# Altium schematic sheet SY8029AIC.SchDoc
size A4
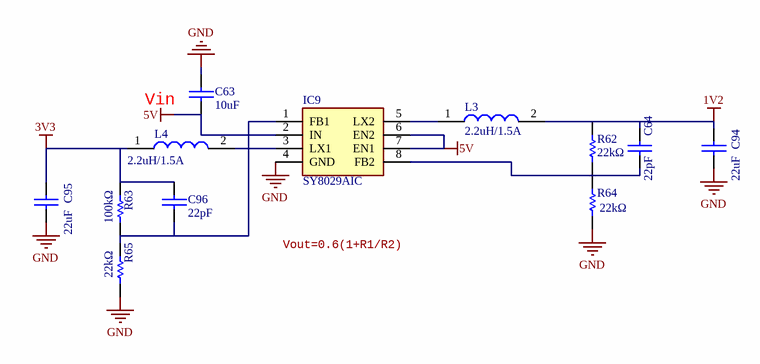
[diagram p0: SY8029AIC.SchDoc]

## Parts
C63  10uF  [C_0805]
C64  22pF  [C_0402]
C94  22uF  [C_0603]
C95  22uF  [C_0603]
C96  22pF  [C_0402]
IC9  SY8029AIC  [SOT23-8]
L3  2.2uH/1.5A  [INDC2520X100N]
L4  2.2uH/1.5A  [INDC2520X100N]
R62  22kΩ  [R_0402]
R63  100kΩ  [R_0402]
R64  22kΩ  [R_0402]
R65  22kΩ  [R_0402]

## Nets
1V2: C64.1 C94.1 L3.2 R62.2
3V3: C95.1 C96.2 L4.1 R63.1
5V: C63.1 IC9.2(IN) IC9.6(EN2) IC9.7(EN1)
GND: C63.2 C94.2 C95.2 IC9.4(GND) R64.1 R65.2
NetC64_2: C64.2 IC9.8(FB2) R62.1 R64.2
NetC96_1: C96.1 IC9.1(FB1) R63.2 R65.1
NetIC9_3: IC9.3(LX1) L4.2
NetIC9_5: IC9.5(LX2) L3.1

## Notes on the sheet
- Vin
- Vout=0.6(1+R1/R2)

## Library data of the parts
C63 C64 C94-C96 = Cap_Chip: 贴片电容; 厂家型号: *; 商品编号: *
IC9 = SY8029AIC: DC-DC降压芯片; Manufacturer_Name: Silergy Corp; Manufacturer_Part_Number: SY8029AIC
L3 L4 = MLP2520K1R0MT0S1: Inductor; Manufacturer_Name: TDK; Manufacturer_Part_Number: MLP2520K1R0MT0S1; LCSC: C383383
R62-R65 = Res_Chip: 贴片电阻; 商品编号: *; 厂家型号: *